# EasyEDA Pro project Board.eprj, board PCB7
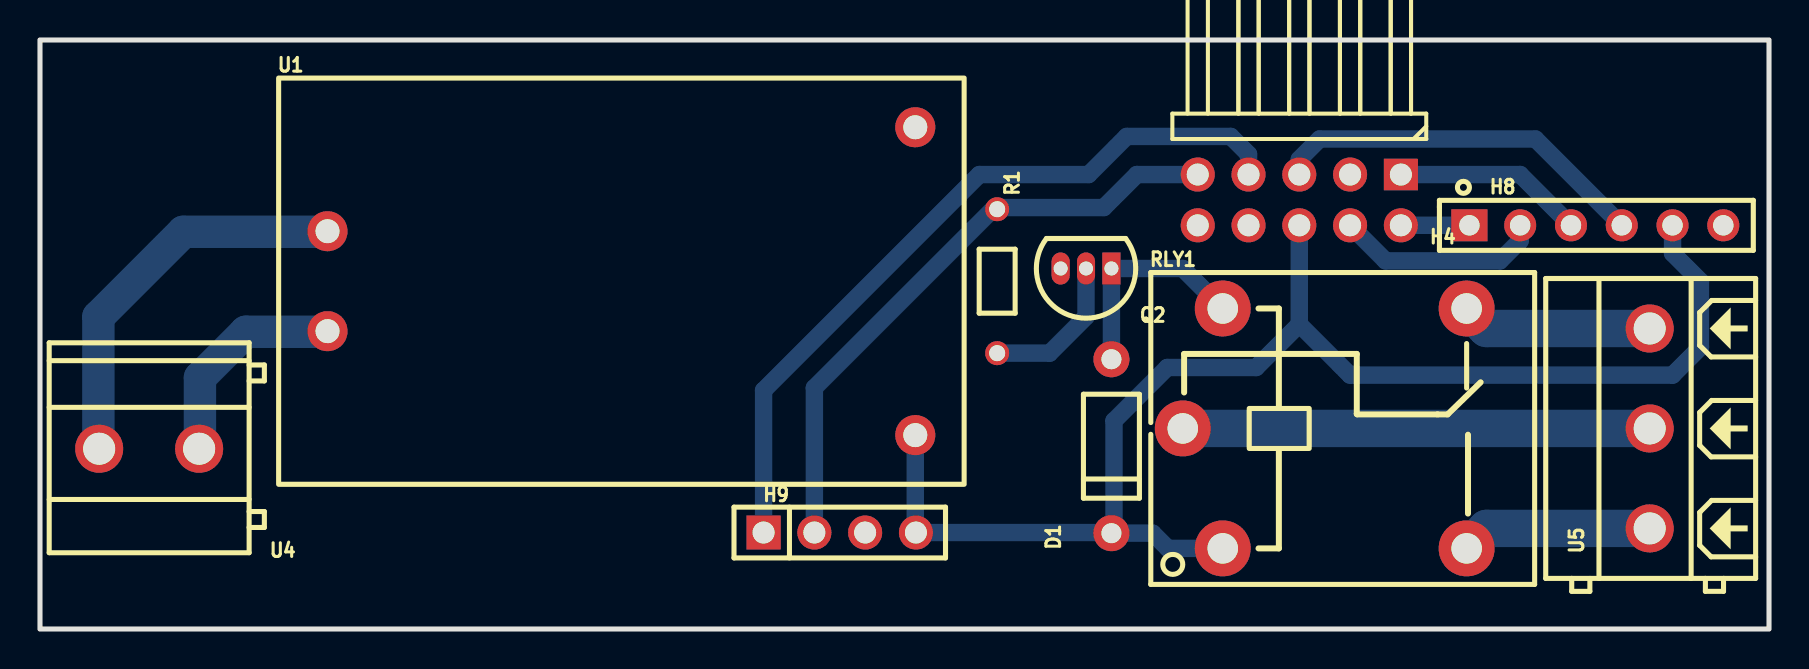
[diagram p6: board, top side]
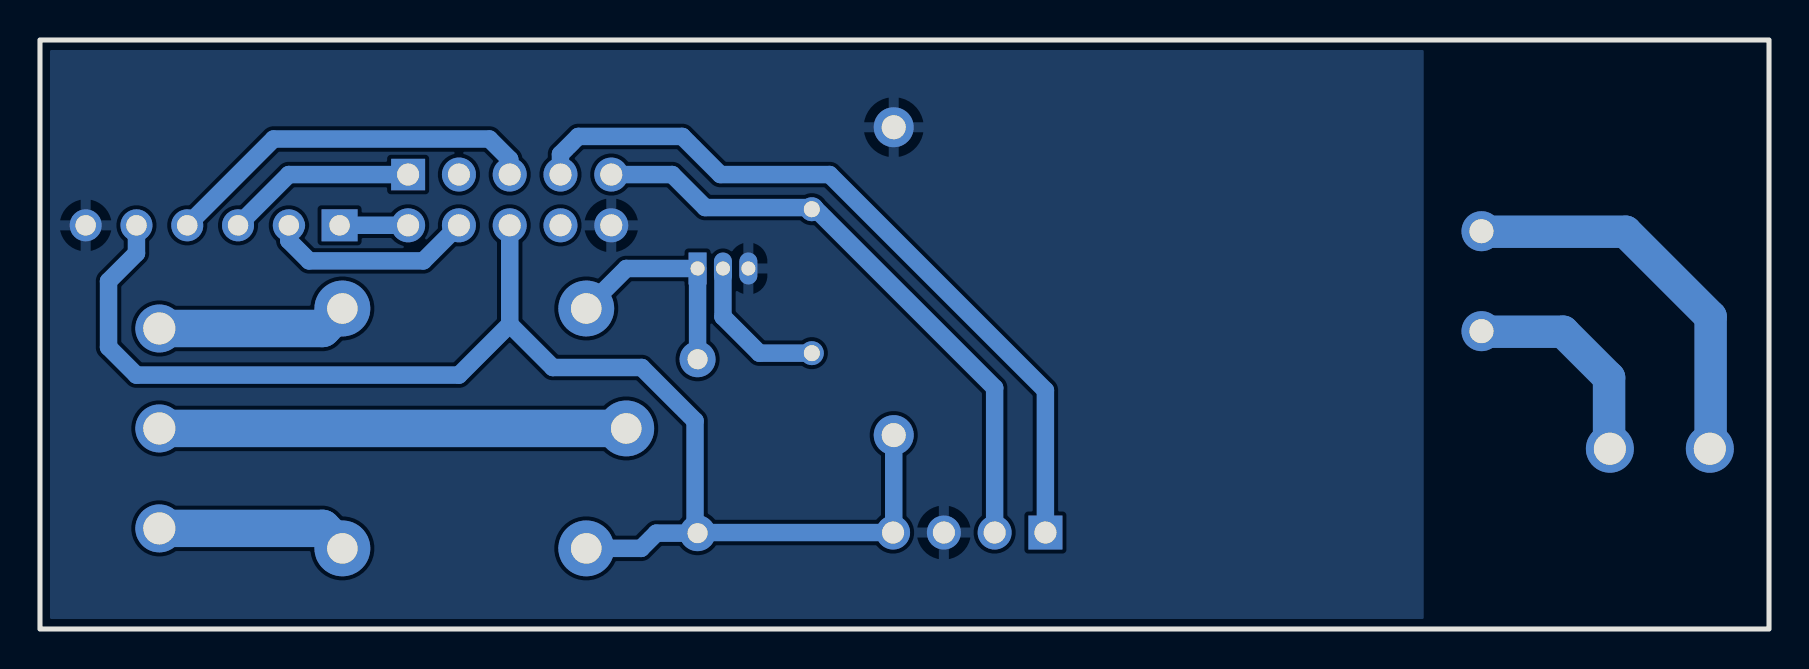
[diagram p7: board, bottom side, seen from below]

Outline 86.49 x 29.46 mm; copper layers: Top Layer, Bottom Layer. Coordinates in mm from the lower left corner of the outline.
Outline path: rectangle 0,29.46 86.49,0
Stack: Top Layer 0.035mm / Dielectric1 1.51mm FR4 er 4.5 / Bottom Layer 0.035mm

## Design rules (mm)
template: Custom Config
spacing copperThickness1oz (default): track to track 0.102, other pairs 0.152 to 0.3
spacing copperThickness2oz: track to track 0.203, other pairs 0.152 to 0.3
track width copperThickness1oz (default): min 0.127, default 0.254, max 2.54
track width copperThickness2oz: min 0.203, default 0.254, max 2.54
differential pair differentialPair (default): width min 0.127, default 0.254, max 2.54; gap min 0.152, default 0.152
via viaSize (default): diameter min 0.5, default 0.61, max 10; hole min 0.3, default 0.305, max 6.3
net GND uses GND

## Placement (name value [footprint] x y rotation side)
D1  -  [DO-41_BD2.4-L4.7-P8.70-D0.9-RD]  53.59 9.14 90 top
H4  2.54-2*5P弯针  [HDR-TH_10P-P2.54-H-M-R2-C5-S2.54-W12.9]  62.99 21.46 180 top
H8  -  [HDR-TH_6P-P2.54-V-F]  77.85 20.19 0 top
H9  -  [HDR-TH_4P-P2.54-V-F]  40 4.83 0 top
Q2  BC548  [TO-92-3_L4.9-W3.7-P1.27-L]  52.32 18.03 180 top
R1  1kΩ  [RES-TH_BD1.8-L3.2-P7.20-D0.4]  47.88 17.4 270 top
RLY1  SRD-05VDC-SL-C  [RELAY-TH_SRD-XXVDC-XL-C]  64.26 10.03 0 top
U1  HLK-PM01  [PWRM-TH_HLK-PM01]  29.08 17.4 0 top
U4  KF128-5.0-2P  [CONN-TH_P5.00_KF128-5.0-2P]  5.46 9.02 180 top
U5  KF128-5.0-3P  [CONN-TH_3P-P5.00_KF128-5.0-3P]  80.52 10.03 90 top

## Footprints (pads in the part's own frame, mm; a bottom-side part is the same pattern mirrored in y, then rotated)
CONN-TH_3P-P5.00_KF128-5.0-3P
  round 2.4 hole 1.6: 1(-5,0) 2(0,0) 3(5,0)
CONN-TH_P5.00_KF128-5.0-2P
  round 2.4 hole 1.6: 1(-2.5,0) 2(2.5,0)
DO-41_BD2.4-L4.7-P8.70-D0.9-RD
  round 1.8 hole 1: 1(-4.35,0) 2(4.35,0)
HDR-TH_4P-P2.54-V-F
  rect 1.7x1.7 hole 1.1: 1(-3.81,0)
  round 1.7 hole 1.1: 2(-1.27,0) 3(1.27,0) 4(3.81,0)
HDR-TH_6P-P2.54-V-F
  rect 1.8x1.6 hole 1.02: 1(-6.35,0)
  round 1.6 hole 1.02: 2(-3.81,0) 3(-1.27,0) 4(1.27,0) 5(3.81,0) 6(6.35,0)
HDR-TH_10P-P2.54-H-M-R2-C5-S2.54-W12.9
  rect 1.7x1.575 hole 1.1: 1(-5.08,-1.27)
  round 1.7 hole 1.1: 2(-5.08,1.27) 3(-2.54,-1.27) 4(-2.54,1.27) 5(0,-1.27) 6(0,1.27) 7(2.54,-1.27) 8(2.54,1.27) 9(5.08,-1.27) 10(5.08,1.27)
PWRM-TH_HLK-PM01
  round 2 hole 1.2: 1(-14.7,2.5) 2(-14.7,-2.5) 3(14.7,7.7) 4(14.7,-7.7)
RELAY-TH_SRD-XXVDC-XL-C
  round 2.794 hole 1.524: 1(-5.1,-6) 2(7.1,-6) 3(7.1,6) 4(-5.1,6) 5(-7.1,0)
RES-TH_BD1.8-L3.2-P7.20-D0.4
  round 1.2 hole 0.8: 1(-3.6,0) 2(3.6,0)
TO-92-3_L4.9-W3.7-P1.27-L
  rect 0.9x1.6 hole 0.7: 1(-1.27,0)
  oval 0.9x1.6 hole 0.7: 2(0,0) 3(1.27,0)

## Nets
As in the schematic.

Pads without a net: H4 3

## Routing (per net, layer and track width the routed paths; a pad name or vN(x,y) marks a point on that pad's centre or on a via; arc(x,y) is an arc through that point)
5V: length 70.6
  Bottom Layer w0.87: H9.4 53.56,4.83 D1.1 ; H8.5 81.66,18.8 83.06,17.4 83.06,14.1 81.66,12.7 65.53,12.7 62.99,15.24 ; D1.1 53.72,4.92 53.72,10.41 56.39,13.08 60.83,13.08 62.99,15.24 ; D1.1 55.66,4.79 56.42,4.03 RLY1.1 ; H4.6 62.99,15.24 ; U1.4 43.78,5.11 43.81,5.08
IO32: length 38
  Bottom Layer w0.87: H9.1 36.19,11.94 46.99,22.73 52.45,22.73 54.36,24.64 59.56,24.64 60.45,23.75 H4.7
IO33: length 30.8
  Bottom Layer w0.87: H9.2 38.73,12.06 47.75,21.08 53.21,21.08 54.86,22.73 57.91,22.73
RX: length 9.6
  Bottom Layer w0.87: H8.3 74.04,22.73 H4.1
SCL: length 10.6
  Bottom Layer w0.87: H4.4 67.31,18.42 73.03,18.42 74.04,19.43 74.04,19.81 73.66,20.19
SDA: length 3.4
  Bottom Layer w0.87: H8.1 H4.2
TX: length 19.1
  Bottom Layer w0.87: H4.5 62.99,23.5 64.01,24.51 74.8,24.51 H8.4
$1N407: length 9.6
  Bottom Layer w1.87: U5.3 72.36,15.03 RLY1.3
$1N669: length 7.6
  Bottom Layer w0.87: Q2.2 52.32,15.62 50.5,13.8 R1.2
$1N719: length 19.9
  Bottom Layer w1.62: U4.2 2.92,9.06 2.92,15.62 7.17,19.87 14.35,19.87 U1.1
$1N726: length 10.9
  Bottom Layer w1.62: U4.1 8,9.06 8,12.57 10.3,14.87 14.35,14.87 U1.2
$1N778: length 23.4
  Bottom Layer w1.87: RLY1.5 U5.2
$1N787: length 9.6
  Bottom Layer w1.87: RLY1.2 72.36,5.03 U5.1
$1N2276: length 10.9
  Bottom Layer w0.87: D1.2 Q2.1 57.16,18.03 RLY1.4

## Copper pours and planes (outline as drawn; the poured copper is in the pictures)
GND on Bottom Layer: 17.27,29.59 86.65,29.59 86.65,-0.08 17.27,-0.08
